# Altium schematic sheet ESPTempMonitorSch.SchDoc: ESP Temp Monitor
size A3; Engineer: D Harvie; Organization: Reposit; Address1: Address; DocumentNumber: 1; SheetNumber: 1; SheetTotal: 1; URL: https://forum.makehackvoid.com/t/esp-battery-thing/1178
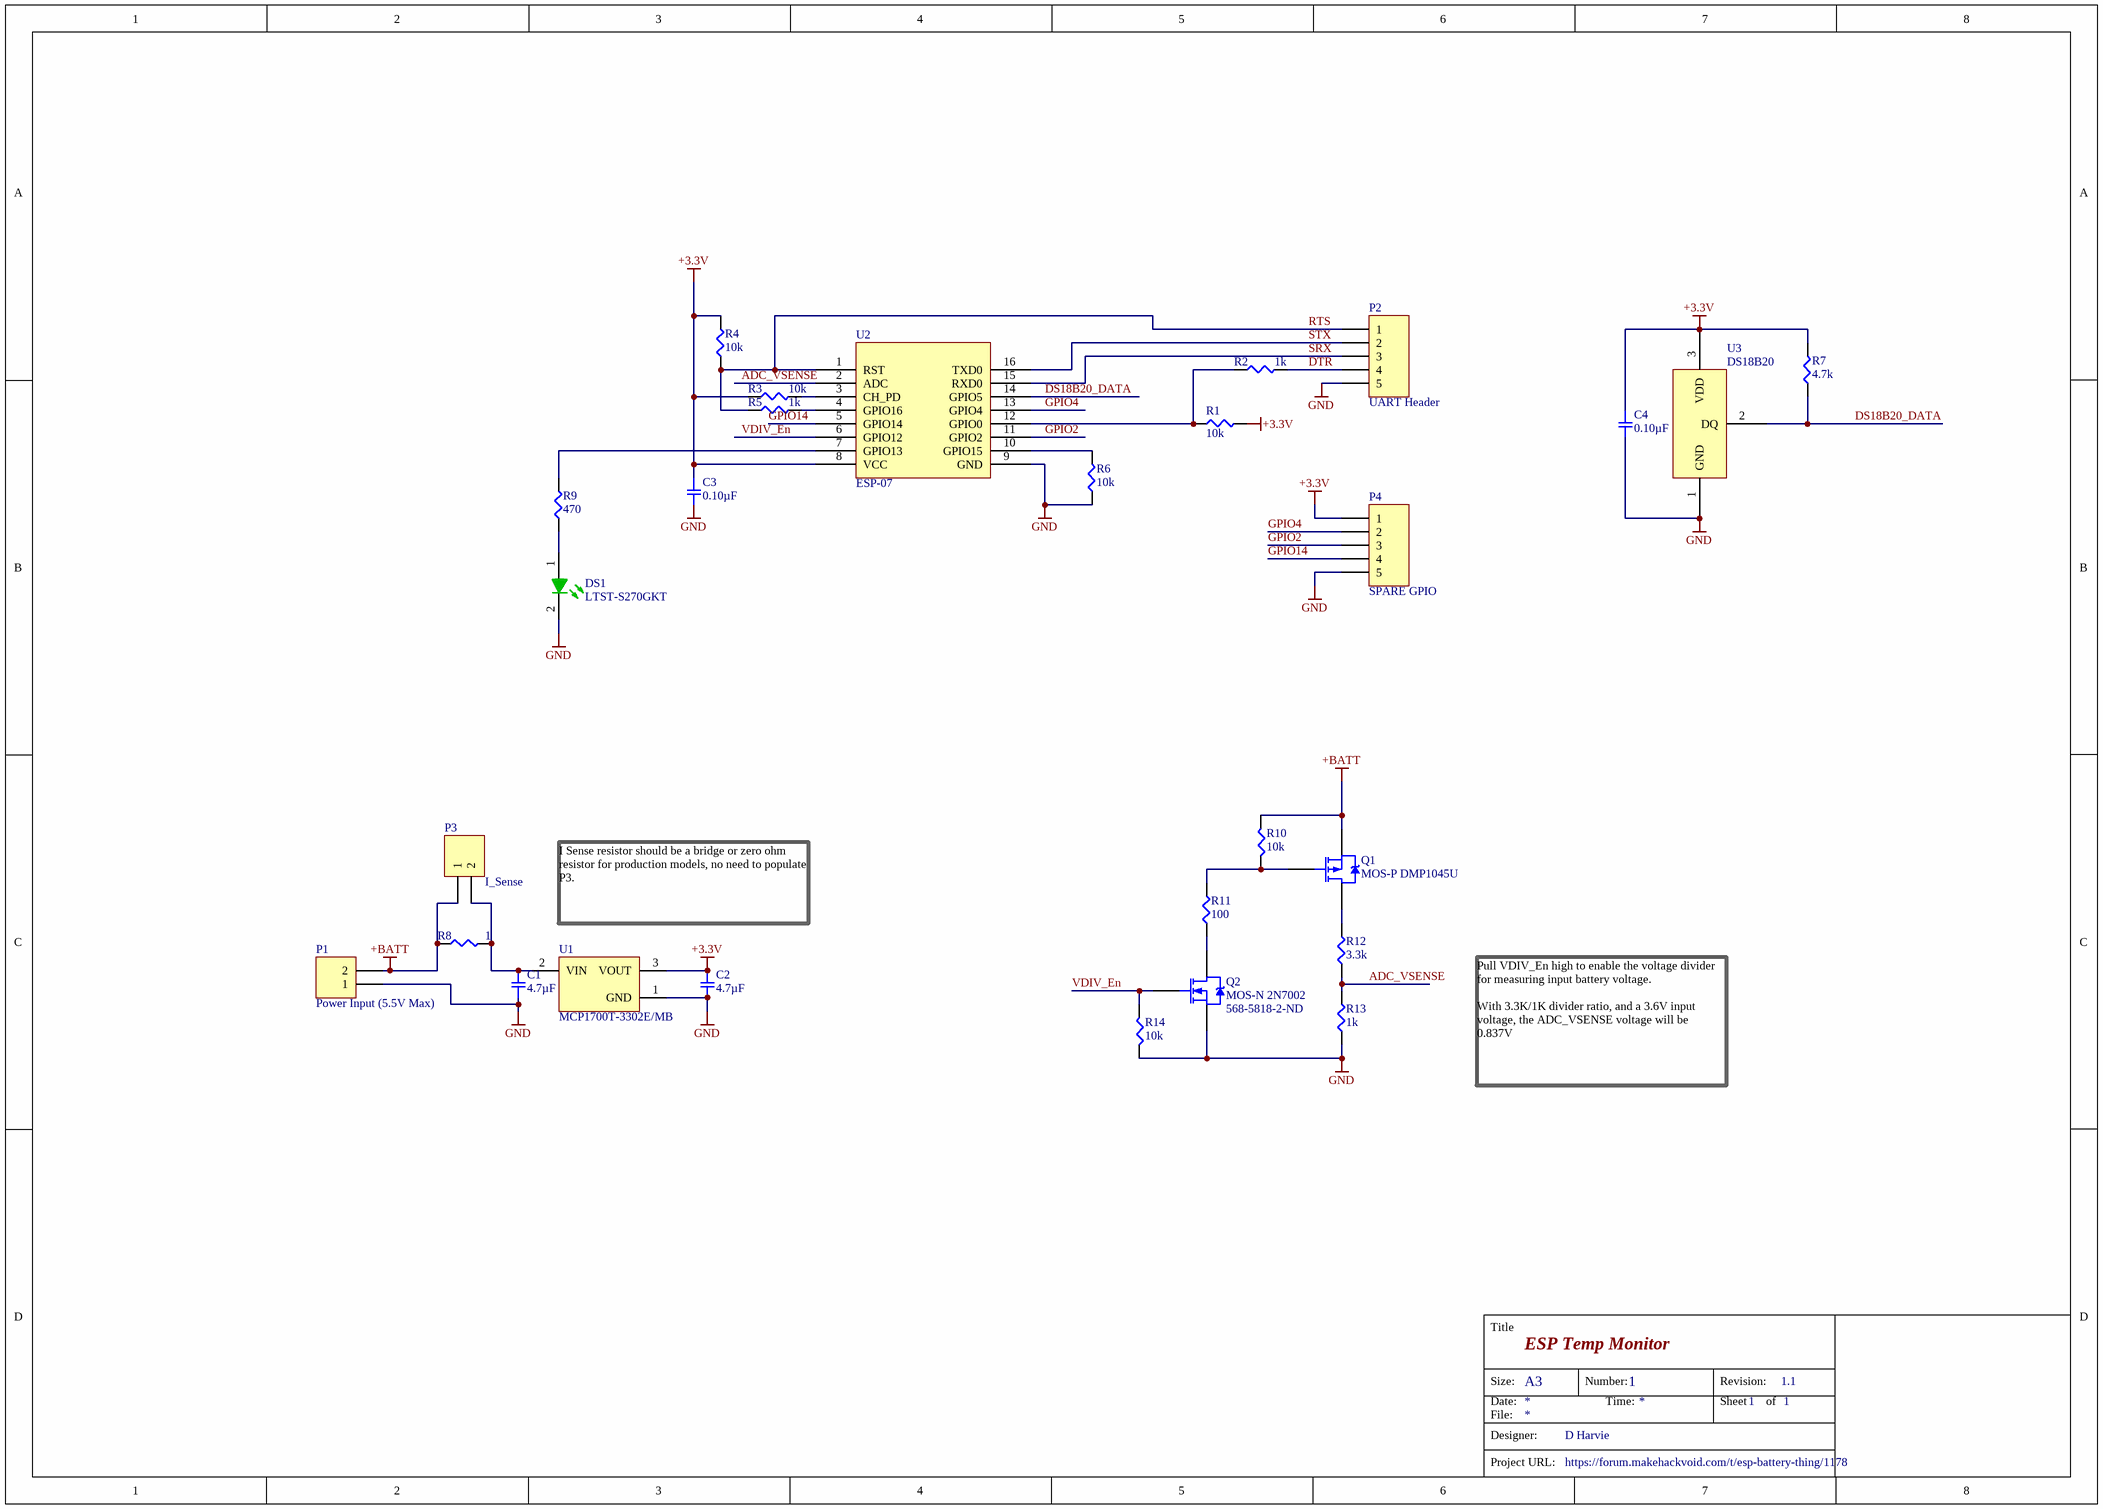
[diagram p0: ESPTempMonitorSch.SchDoc]

## Parts
C1  4.7µF  [SMD-0805C]
C2  4.7µF  [SMD-0805C]
C3  0.10µF  [SMD-0603C]
C4  0.10µF  [SMD-0603C]
DS1  LTST-S270GKT  [KING-0603LED_GREEN_V]
P1  Power Input (5.5V Max)  [HDR1X2]
P2  UART Header  [HDR1X5]
P3  I_Sense  [HDR1X2]
P4  SPARE GPIO  [HDR1X5]
Q1  MOS-P DMP1045U  [SOT-23B_N]
Q2  MOS-N 2N7002  Supplier Part Number 1: 568-5818-2-ND  [SOT-23B_N]
R1  10k  [SMD-0603-RES]
R2  1k  [SMD-0603-RES]
R3  10k  [SMD-0603-RES]
R4  10k  [SMD-0603-RES]
R5  1k  [SMD-0603-RES]
R6  10k  [SMD-0603-RES]
R7  4.7k  [SMD-0603-RES]
R8  1  [SMD-0603-RES]
R9  470  [SMD-0603-RES]
R10  10k  [SMD-0603-RES]
R11  100  [SMD-0603-RES]
R12  3.3k  [SMD-0603-RES]
R13  1k  [SMD-0603-RES]
R14  10k  [SMD-0603-RES]
U1  MCP1700T-3302E/MB  [SOT-89-MB3_M]
U2  ESP-07  [ESP-07]
U3  DS18B20  [DS18B20-SIDE]

## Nets
+3.3V: C2.1 C3.1 C4.1 P4.1 R1.2 R3.1 R4.2 R7.2 U1.3(VOUT) U2.8(VCC) U3.3(VDD)
+BATT: P1.2 P3.1 Q1.2(S) R8.1 R10.2
GND: C1.2 C2.2 C3.2 C4.2 DS1.2(K) P1.1 P2.5 P4.5 Q2.2(S) R6.1 R13.1 R14.1 U1.1(GND) U2.9(GND) U3.1(GND)
ADC_VSENSE: R12.1 R13.2 U2.2(ADC)
DS18B20_DATA: R7.1 U2.14(GPIO5) U3.2(DQ)
DTR: P2.4 R2.2
GPIO2: P4.3 U2.11(GPIO2)
GPIO4: P4.2 U2.13(GPIO4)
GPIO14: P4.4 U2.5(GPIO14)
RTS: P2.1 R4.1 R5.1 U2.1(RST)
SRX: P2.3 U2.15(RXD0)
STX: P2.2 U2.16(TXD0)
VDIV_En: Q2.1(G) R14.2 U2.6(GPIO12)
NetC1_1: C1.1 P3.2 R8.2 U1.2(VIN)
NetDS1_1: DS1.1(A) R9.1
NetQ1_1: Q1.1(G) R10.1 R11.2
NetQ1_3: Q1.3(D) R12.2
NetQ2_3: Q2.3(D) R11.1
NetR1_1: R1.1 R2.1 U2.12(GPIO0)
NetR3_2: R3.2 U2.3(CH_PD)
NetR5_2: R5.2 U2.4(GPIO16)
NetR6_2: R6.2 U2.10(GPIO15)
NetR9_2: R9.2 U2.7(GPIO13)

## Notes on the sheet
- I Sense resistor should be a bridge or zero ohm resistor for production models, no need to populate P3.
- Pull VDIV_En high to enable the voltage divider for measuring input battery voltage.
  With 3.3K/1K divider ratio, and a 3.6V input voltage, the ADC_VSENSE voltage will be 0.837V
- 1.1
- Title
- Size:
- A3
- Number:
- Revision:
- Date:
- File:
- Designer:
- Time:
- Sheet
- of
- Project URL:

## Library data of the parts
C1 C2 = GCJ21BR71C475KA01L: CAP CER 4.7UF 16V X7R 0805; Manufacturer: Murata Electronics North America; Factory Stock: 0; Unit Price (USD): 0.44; Minimum Quantity: 1; Tolerance: ±10%; Datasheets: http://www.murata.com/~/media/webrenewal/support/library/catalog/products/capacitor/mlcc/c03e.ashx; Image: //media.digikey.com/Renders/Murata%20Renders/0805%20(2012%20Metric)%20.85mm.jpg; Digi-Key Part Number: 490-10557-1-ND; Part Number: GCJ21BR71C475KA01L; Quantity Available: 53217; @ qty: 0; Packaging: Cut Tape (CT); Series: GCJ; Part Status: Active; Value: 4.7µF; Voltage: 16V; Temperature Coefficient: X7R; Operating Temperature: -55°C ~ 125°C; Features: Soft Termination; Ratings: AEC-Q200; Applications: Automotive, Boardflex Sensitive; Mounting Type: Surface Mount, MLCC; Package / Case: 0805 (2012 Metric); Size / Dimension: 0.079" L x 0.049" W (2.00mm x 1.25mm); Height - Seated (Max): -; Thickness (Max): 0.057" (1.45mm); Lead Spacing: -; Lead Style: -
C3 C4 = GCJ188R71C104KA01D: CAP CER 0.1UF 16V X7R 0603; Manufacturer: Murata Electronics North America; Factory Stock: 0; Unit Price (USD): 0.21; Minimum Quantity: 1; Tolerance: ±10%; Datasheets: http://www.murata.com/~/media/webrenewal/support/library/catalog/products/capacitor/mlcc/c03e.ashx; Image: //media.digikey.com/Renders/Murata%20Renders/0603%28LQG18%29.jpg; Digi-Key Part Number: 490-5796-1-ND; Part Number: GCJ188R71C104KA01D; Quantity Available: 22473; @ qty: 0; Packaging: Cut Tape (CT); Series: GCJ; Part Status: Active; Value: 0.10µF; Voltage: 16V; Temperature Coefficient: X7R; Operating Temperature: -55°C ~ 125°C; Features: Soft Termination; Ratings: AEC-Q200; Applications: Automotive, Boardflex Sensitive; Mounting Type: Surface Mount, MLCC; Package / Case: 0603 (1608 Metric); Size / Dimension: 0.063" L x 0.031" W (1.60mm x 0.80mm); Height - Seated (Max): -; Thickness (Max): 0.035" (0.90mm); Lead Spacing: -; Lead Style: -
DS1 = SMD - LED - Discrete - 0603 - Green: Green 569nm LED Indication - Discrete 2.1V 0603; Supplier 1: Octopart; Supplier 2: Octopart; Supplier Part Number 1: Digi-Key - 160-1475-1-ND; Supplier Part Number 2: Arrow - LTST-S270GKT**MULT1
P1 P3 = Header 2: Power Input; LatestRevisionDate: 17-Jul-2002; LatestRevisionNote: Re-released for DXP Platform.; Publisher: Altium Limited
P2 P4 = Header 5: Header, 5-Pin; LatestRevisionDate: 17-Jul-2002; LatestRevisionNote: Re-released for DXP Platform.; Publisher: Altium Limited
Q1 = MOS-P DMP1045U: PMOS-DMP1045U; Note: Pin 4 not drawn and electrically connected to Pin 2.; Published: 8-Jun-2000; LatestRevisionDate: 17-Jul-2002; LatestRevisionNote: Re-released for DXP Platform.; DatasheetVersion: PD-9.390D; PackageVersion: Feb-1997; PackageReference: TO-220AB; Publisher: Altium Limited; PackageDescription: TO, Thru-Hole, Vertical, Heatsink Mounted; 3 In-Line Leads; Pitch 2.54 mm; ComponentLink1Description: Manufacturer Link; ComponentLink1URL: http://www.irf.com/
Q2 = MOS-N 2N7002: N-MOSFET 2N7002 NXP; Published: 8-Jun-2000; LatestRevisionDate: 17-Jul-2002; LatestRevisionNote: Re-released for DXP Platform.; DatasheetVersion: PD-9.814; PackageVersion: Feb-1997; PackageReference: SOT23; Publisher: Altium Limited; PackageDescription: TO, Thru-Hole, Vertical, Heatsink Mounted; 3 In-Line Leads; Pitch 2.54 mm; ComponentLink1Description: Manufacturer Link; ComponentLink1URL: http://www.irf.com/; Supplier 1: Digi-Key
R1 R3 R4 R6 R10 R14 = ERJ-3GEYJ103V: RES SMD 10K OHM 5% 1/10W 0603; Manufacturer: Panasonic Electronic Components; Factory Stock: 0; Unit Price (USD): 0.00321; @ qty: 1500; Minimum Quantity: 1; Power (Watts): 0.1W, 1/10W; Temperature Coefficient: ±200ppm/°C; Part Number: ERJ-3GEYJ103V; Datasheets: http://industrial.panasonic.com/www-cgi/jvcr13pz.cgi?E+PZ+3+AOA0001+ERJ3GEYJ103V+7+WW; Image: //media.digikey.com/Photos/Panasonic%20Photos/MFG_ERJ-P6W%20Series.jpg; Digi-Key Part Number: P10KGCT-ND; Quantity Available: 7178118; Packaging: Cut Tape (CT); Series: ERJ; Part Status: Active; Value: 10k; Tolerance: ±5%; Composition: Thick Film; Features: Automotive AEC-Q200; Operating Temperature: -55°C ~ 155°C; Package / Case: 0603 (1608 Metric); Supplier Device Package: 0603; Size / Dimension: 0.063" L x 0.031" W (1.60mm x 0.80mm); Height - Seated (Max): 0.022" (0.55mm); Number of Terminations: 2; Failure Rate: -
R2 R5 R13 = ERJ-3EKF1001V: RES SMD 1K OHM 1% 1/10W 0603; Manufacturer: Panasonic Electronic Components; Factory Stock: 0; Unit Price (USD): 0.00379; @ qty: 1500; Minimum Quantity: 1; Power (Watts): 0.1W, 1/10W; Temperature Coefficient: ±100ppm/°C; Part Number: ERJ-3EKF1001V; Datasheets: http://industrial.panasonic.com/www-cgi/jvcr13pz.cgi?E+PZ+3+AOA0002+ERJ3EKF1001V+7+WW; Image: //media.digikey.com/Photos/Panasonic%20Photos/MFG_ERJ-P6W%20Series.jpg; Digi-Key Part Number: P1.00KHCT-ND; Quantity Available: 5218845; Packaging: Cut Tape (CT); Series: ERJ; Part Status: Active; Value: 1k; Tolerance: ±1%; Composition: Thick Film; Features: Automotive AEC-Q200; Operating Temperature: -55°C ~ 155°C; Package / Case: 0603 (1608 Metric); Supplier Device Package: 0603; Size / Dimension: 0.063" L x 0.031" W (1.60mm x 0.80mm); Height - Seated (Max): 0.022" (0.55mm); Number of Terminations: 2; Failure Rate: -
R7 = ERJ-3GEYJ472V: RES SMD 4.7K OHM 5% 1/10W 0603; Manufacturer: Panasonic Electronic Components; Factory Stock: 0; Unit Price (USD): 0.00321; @ qty: 1500; Minimum Quantity: 1; Power (Watts): 0.1W, 1/10W; Temperature Coefficient: ±200ppm/°C; Part Number: ERJ-3GEYJ472V; Datasheets: http://industrial.panasonic.com/www-cgi/jvcr13pz.cgi?E+PZ+3+AOA0001+ERJ3GEYJ472V+7+WW; Image: //media.digikey.com/Photos/Panasonic%20Photos/MFG_ERJ-P6W%20Series.jpg; Digi-Key Part Number: P4.7KGCT-ND; Quantity Available: 683531; Packaging: Cut Tape (CT); Series: ERJ; Part Status: Active; Value: 4.7k; Tolerance: ±5%; Composition: Thick Film; Features: Automotive AEC-Q200; Operating Temperature: -55°C ~ 155°C; Package / Case: 0603 (1608 Metric); Supplier Device Package: 0603; Size / Dimension: 0.063" L x 0.031" W (1.60mm x 0.80mm); Height - Seated (Max): 0.022" (0.55mm); Number of Terminations: 2; Failure Rate: -
R8 = ERJ-3BQF1R0V: RES SMD 1 OHM 1% 1/4W 0603; Manufacturer: Panasonic Electronic Components; Factory Stock: 0; Unit Price (USD): 0.05386; @ qty: 1500; Power (Watts): 0.25W, 1/4W; Temperature Coefficient: ±200ppm/°C; Part Number: ERJ-3BQF1R0V; Datasheets: https://industrial.panasonic.com/cdbs/www-data/pdf/RDA0000/AOA0000C239.pdf; Image: //media.digikey.com/Photos/Panasonic%20Photos/MFG_ERJ-P6W%20Series.jpg; Digi-Key Part Number: P17371CT-ND; Quantity Available: 30514; Minimum Quantity: 1; Packaging: Cut Tape (CT); Series: ERJ; Part Status: Active; Value: 1; Tolerance: ±1%; Composition: Thick Film; Features: Automotive AEC-Q200, Current Sense; Operating Temperature: -55°C ~ 125°C; Package / Case: 0603 (1608 Metric); Supplier Device Package: 0603; Size / Dimension: 0.063" L x 0.031" W (1.60mm x 0.80mm); Height - Seated (Max): 0.022" (0.55mm); Number of Terminations: 2; Failure Rate: -
R9 = ERJ-3GEYJ471V: RES SMD 470 OHM 5% 1/10W 0603; Manufacturer: Panasonic Electronic Components; Factory Stock: 0; Unit Price (USD): 0.00321; @ qty: 1500; Minimum Quantity: 1; Power (Watts): 0.1W, 1/10W; Temperature Coefficient: ±200ppm/°C; Part Number: ERJ-3GEYJ471V; Datasheets: http://industrial.panasonic.com/www-cgi/jvcr13pz.cgi?E+PZ+3+AOA0001+ERJ3GEYJ471V+7+WW; Image: //media.digikey.com/Photos/Panasonic%20Photos/MFG_ERJ-P6W%20Series.jpg; Digi-Key Part Number: P470GCT-ND; Quantity Available: 874105; Packaging: Cut Tape (CT); Series: ERJ; Part Status: Active; Value: 470; Tolerance: ±5%; Composition: Thick Film; Features: Automotive AEC-Q200; Operating Temperature: -55°C ~ 155°C; Package / Case: 0603 (1608 Metric); Supplier Device Package: 0603; Size / Dimension: 0.063" L x 0.031" W (1.60mm x 0.80mm); Height - Seated (Max): 0.022" (0.55mm); Number of Terminations: 2; Failure Rate: -
R11 = ERJ-3EKF1000V: RES SMD 100 OHM 1% 1/10W 0603; Manufacturer: Panasonic Electronic Components; Factory Stock: 0; Unit Price (USD): 0.00379; @ qty: 1500; Minimum Quantity: 1; Power (Watts): 0.1W, 1/10W; Temperature Coefficient: ±100ppm/°C; Part Number: ERJ-3EKF1000V; Datasheets: http://industrial.panasonic.com/www-cgi/jvcr13pz.cgi?E+PZ+3+AOA0002+ERJ3EKF1000V+7+WW; Image: //media.digikey.com/Photos/Panasonic%20Photos/MFG_ERJ-P6W%20Series.jpg; Digi-Key Part Number: P100HCT-ND; Quantity Available: 1544120; Packaging: Cut Tape (CT); Series: ERJ; Part Status: Active; Value: 100; Tolerance: ±1%; Composition: Thick Film; Features: Automotive AEC-Q200; Operating Temperature: -55°C ~ 155°C; Package / Case: 0603 (1608 Metric); Supplier Device Package: 0603; Size / Dimension: 0.063" L x 0.031" W (1.60mm x 0.80mm); Height - Seated (Max): 0.022" (0.55mm); Number of Terminations: 2; Failure Rate: -
R12 = ERJ-3EKF3301V: RES SMD 3.3K OHM 1% 1/10W 0603; Manufacturer: Panasonic Electronic Components; Factory Stock: 0; Unit Price (USD): 0.00379; @ qty: 1500; Minimum Quantity: 1; Power (Watts): 0.1W, 1/10W; Temperature Coefficient: ±100ppm/°C; Part Number: ERJ-3EKF3301V; Datasheets: http://industrial.panasonic.com/www-cgi/jvcr13pz.cgi?E+PZ+3+AOA0002+ERJ3EKF3301V+7+WW; Image: //media.digikey.com/Photos/Panasonic%20Photos/MFG_ERJ-P6W%20Series.jpg; Digi-Key Part Number: P3.30KHCT-ND; Quantity Available: 291380; Packaging: Cut Tape (CT); Series: ERJ; Part Status: Active; Value: 3.3k; Tolerance: ±1%; Composition: Thick Film; Features: Automotive AEC-Q200; Operating Temperature: -55°C ~ 155°C; Package / Case: 0603 (1608 Metric); Supplier Device Package: 0603; Size / Dimension: 0.063" L x 0.031" W (1.60mm x 0.80mm); Height - Seated (Max): 0.022" (0.55mm); Number of Terminations: 2; Failure Rate: -
U1 = CMP-0136-00812-1: Low Quiescent Current LDO, 3-Pin SOT-89, Extended Temperature, Tape and Reel; PackageDescription: 3-Lead Plastic Small Outline Transistor Header (MB) [SOT-89]; PackageReference: SOT-89-MB3; DatasheetVersion: revB, Feb-2007; Code_IPC: SOT89; PackageVersion: revBB, Aug-2009
U2 = ESP-07: ESP8266 ESP-07 Module
U3 = DS18B20: SENSOR TEMPERATURE 1-WIRE TO92-3